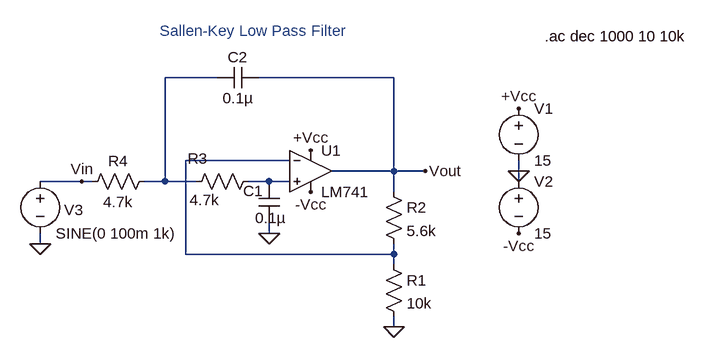
[diagram p0: schematic LPF.asc]
LPF.asc, the LTspice schematic file:
Version 4
SHEET 1 880 680
WIRE 80 0 0 0
WIRE 352 0 144 0
WIRE 192 128 32 128
WIRE 352 144 352 0
WIRE 352 144 256 144
WIRE 400 144 352 144
WIRE 544 144 544 128
WIRE -128 160 -192 160
WIRE -112 160 -128 160
WIRE 0 160 0 0
WIRE 0 160 -32 160
WIRE 48 160 0 160
WIRE 160 160 128 160
WIRE 192 160 160 160
WIRE 544 160 544 144
WIRE 352 176 352 144
WIRE 160 240 160 224
WIRE -192 256 -192 240
WIRE 32 272 32 128
WIRE 352 272 352 256
WIRE 352 272 32 272
WIRE 352 288 352 272
WIRE 352 384 352 368
FLAG 544 144 0
FLAG 544 48 +Vcc
FLAG 544 240 -Vcc
FLAG 224 176 -Vcc
FLAG 224 112 +Vcc
FLAG 352 384 0
FLAG -192 256 0
FLAG 160 240 0
FLAG 400 144 Vout
FLAG -128 160 Vin
SYMBOL Opamps\\LM741 224 80 R0
SYMATTR InstName U1
SYMBOL voltage 544 32 R0
SYMATTR InstName V1
SYMATTR Value 15
SYMBOL voltage 544 144 R0
SYMATTR InstName V2
SYMATTR Value 15
SYMBOL res 336 160 R0
SYMATTR InstName R2
SYMATTR Value 5.6k
SYMBOL res 336 272 R0
SYMATTR InstName R1
SYMATTR Value 10k
SYMBOL res -16 144 R90
WINDOW 0 0 56 VBottom 2
WINDOW 3 32 56 VTop 2
SYMATTR InstName R4
SYMATTR Value 4.7k
SYMBOL res 144 144 R90
WINDOW 0 -4 94 VBottom 2
WINDOW 3 29 83 VTop 2
SYMATTR InstName R3
SYMATTR Value 4.7k
SYMBOL cap 144 -16 R90
WINDOW 0 0 32 VBottom 2
WINDOW 3 32 32 VTop 2
SYMATTR InstName C2
SYMATTR Value 0.1µ
SYMBOL cap 176 224 R180
WINDOW 0 25 49 Left 2
WINDOW 3 -10 8 Left 2
SYMATTR InstName C1
SYMATTR Value 0.1µ
SYMBOL voltage -192 144 R0
WINDOW 39 0 0 Left 2
WINDOW 0 37 60 Left 2
SYMATTR InstName V3
SYMATTR Value SINE(0 100m 1k)
SYMATTR Value2 AC 100m 0
TEXT 584 -64 Left 2 !.ac dec 1000 10 10k
TEXT -8 -72 Left 2 ;Sallen-Key Low Pass Filter

The netlist it stands for:
* LPF.asc
XU1 N003 N002 +Vcc -Vcc Vout LM741  ; pins In+ In- V+ V- OUT
V1 +Vcc 0 15
V2 0 -Vcc 15
R2 Vout N002 5.6k
R1 N002 0 10k
R4 N001 Vin 4.7k
R3 N003 N001 4.7k
C2 Vout N001 0.1µ
C1 0 N003 0.1µ
V3 Vin 0 SINE(0 100m 1k) AC 100m 0
.ac dec 1000 10 10k
* Sallen-Key Low Pass Filter
.lib LM741.lib
.backanno
.end